# EAGLE design 555_556_Tester 2 (EAGLE 8.1.0)
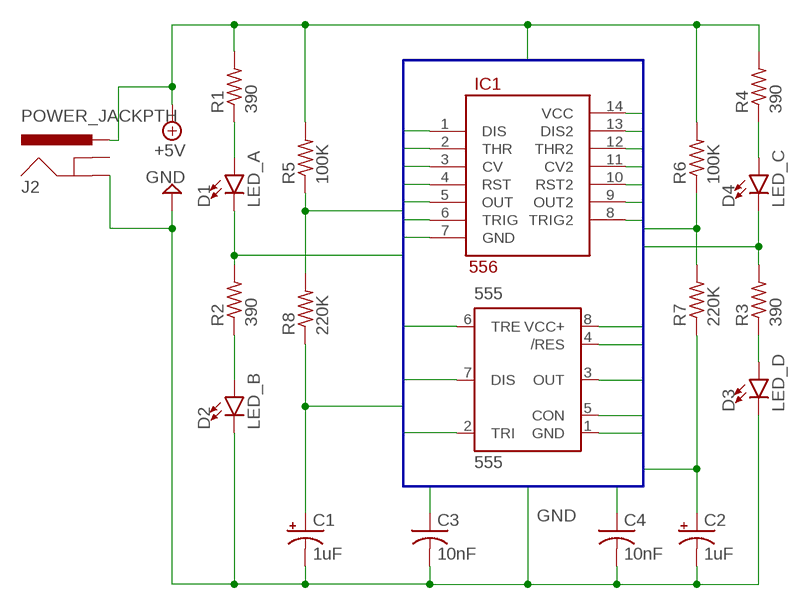
[diagram p0: schematic, sheet 1]

## Parts
555  555  NE555KIT  [DIP08-KIT]
C1  1uF  CPOL-USE2-4  [E2-4]
C2  1uF  CPOL-USE2-4  [E2-4]
C3  10nF  C-US025-025X050  [C025-025X050]
C4  10nF  C-US025-025X050  [C025-025X050]
D1  LED_A  LED3MM  [LED_3MM]
D2  LED_B  LED3MM  [LED_3MM]
D3  LED_D  LED3MM  [LED_3MM]
D4  LED_C  LED3MM  [LED_3MM]
IC1  556  556KIT  [DIL14-KIT]
J2  POWER_JACKPTH  [POWER_JACK_PTH]
R1  390  R-US_0204/5  [0204/5]
R2  390  R-US_0204/5  [0204/5]
R3  390  R-US_0204/5  [0204/5]
R4  390  R-US_0204/5  [0204/5]
R5  100K  R-US_0204/5  [0204/5]
R6  100K  R-US_0204/5  [0204/5]
R7  220K  R-US_0204/5  [0204/5]
R8  220K  R-US_0204/5  [0204/5]

## Nets
+5V: 555.4(/RES) 555.8(VCC+) IC1.4(RST) IC1.10(RST2) IC1.14(VCC) J2.PWR R1.2 R4.2 R5.2 R6.2
CV: 555.5(CON) C3.1 IC1.3(CV)
CV2: C4.1 IC1.11(CV2)
DIS: 555.7(DIS) IC1.1(DIS) R5.1 R8.2
DIS2: IC1.13(DIS2) R6.1 R7.2
GND: 555.1(GND) C1.- C2.- C3.2 C4.2 D2.K(C) D3.K(C) IC1.7(GND) J2.GND
N$1: D1.A R1.1
N$2: D2.A R2.1
N$6: D3.A R3.1
N$8: D4.A R4.1
OUT: 555.3(OUT) D1.K(C) IC1.5(OUT) R2.2
OUT2: D4.K(C) IC1.9(OUT2) R3.2
THR2_TRIG2: C2.+ IC1.8(TRIG2) IC1.12(THR2) R7.1
THR_TRIG: 555.2(TRI) 555.6(TRE) C1.+ IC1.2(THR) IC1.6(TRIG) R8.1
Unconnected: J2.GNDBREAK

## Buses
GND,DIS,THR_TRIG,CV,RST,OUT,VCC,DIS2,CV2,RST2,OUT2,THR2_TRIG2,+5V

## Library data of the parts
555 = SparkFun-AnalogIC:NE555: General purpose bipolar Timer; PROD_ID: IC-11930
C1 C2 = adafruit:CPOL-US: POLARIZED CAPACITOR, American symbol
C3 C4 = adafruit:C-US: CAPACITOR, American symbol
D1-D4 = SparkFun-LED:LED: LED (Generic) Standard schematic elements and footprints for 5mm, 3mm, 1206, and 0603 sized LEDs. Generic LEDs with no color specified.; PROD_ID: DIO-08794
IC1 = SparkFun-AnalogIC:556: Dual timer circuit (2 555 timers in one package)
J2 = SparkFun-Connectors:POWER_JACK: Power Jack This is the standard 5.5mm barrel jack for power. The PTH is the most common, proven, reliable, footprint. The Slot footprint only works if the mill layer is transmitted to the PCB fab house so be warned. Mating wall wart : TOL-00298 (and others); PROD_ID: CONN-08197
R1-R8 = adafruit:R-US_: RESISTOR, American symbol

## Module YAR
Ports: 

### Library data of the parts

## Board
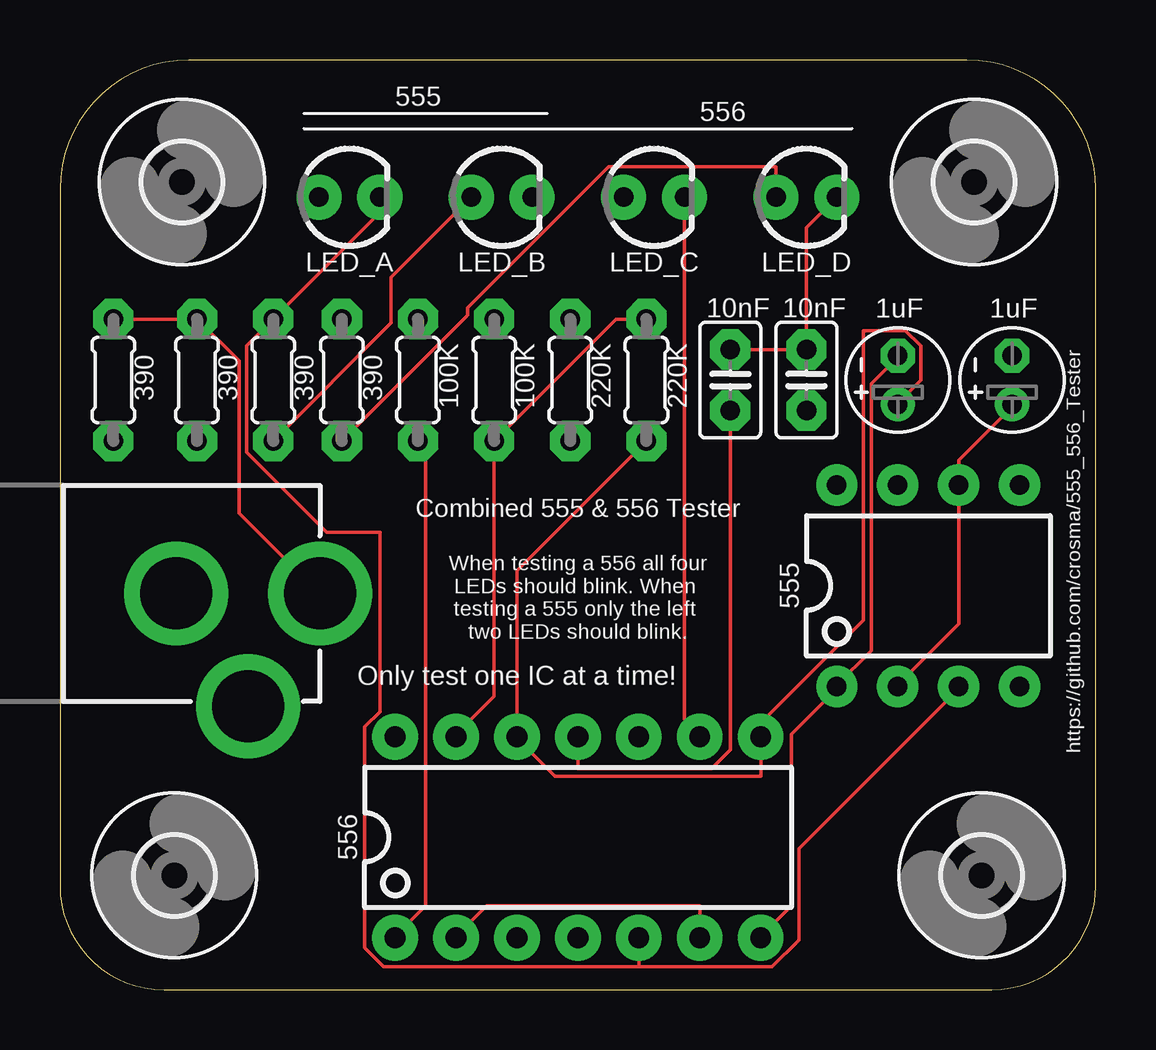
[diagram p1: board, top side]
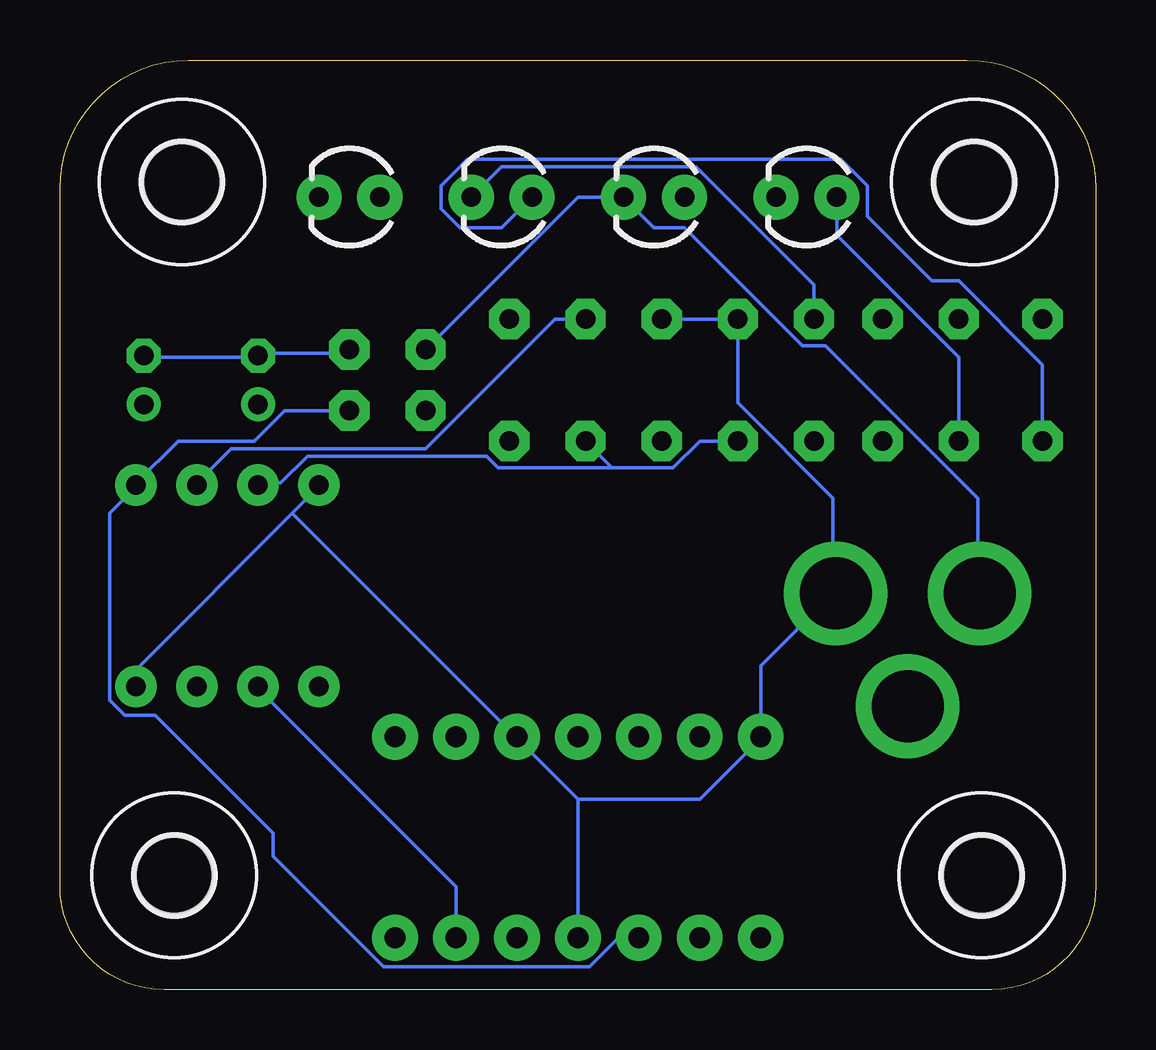
[diagram p2: board, bottom side, seen from below]

Size 43.18 x 38.73 mm. Coordinates in mm from the lower left corner, seen from the top.
Outline: 4.34,0 38.84,0 arc90 43.18,4.34 43.18,33.36 arc90 37.8,38.73 5.38,38.73 arc90 0,33.36 0,4.34 arc90 4.34,0
Copper layers (1*16): Top 0.0356mm / dielectric 1.5011mm / Bottom 0.0356mm
Design rules "oshpark-2layer": minimum track width 6mil, minimum drill 13mil, track to track 6mil, track to pad 6mil, pad to pad 6mil, via to via 6mil, smd to smd 6mil, copper to edge 15mil, drill to drill 6mil, minimum pad ring 7mil, minimum via ring 7mil, stop-mask expansion 2.5mil, vias tented up to drill 0mil, thermal gap 10mil

### Footprints (pad centres in the part's own frame; a part is rotated, then mirrored left to right if it is on the bottom)
DIP08-KIT = drill 0.813 pad 1.727: 1 -3.81,-4.191; 2 -1.27,-4.191; 3 1.27,-4.191; 4 3.81,-4.191; 5 3.81,4.191; 6 1.27,4.191; 7 -1.27,4.191; 8 -3.81,4.191
E2-4 = drill 0.813 pad 1.422: + -1.016,0 | drill 0.813 pad 1.422 octagon: - 1.016,0
C025-025X050 = drill 0.813 pad 1.676 octagon: 1 -1.27,0; 2 1.27,0
LED_3MM = drill 0.813 pad 1.88: A -1.27,0; K 1.27,0
DIL14-KIT = drill 0.864 pad 1.905: 1 -8.89,-4.191; 2 -6.35,-4.191; 3 -3.81,-4.191; 4 -1.27,-4.191; 5 1.27,-4.191; 6 3.81,-4.191; 7 6.35,-4.191; 8 6.35,4.191; 9 3.81,4.191; 10 1.27,4.191; 11 -1.27,4.191; 12 -3.81,4.191; 13 -6.35,4.191; 14 -8.89,4.191
POWER_JACK_PTH = drill 2.997 pad 4.318: GND 0,7.7; GNDBREAK 4.7,10.7; PWR 0,13.7
0204/5 = drill 0.813 pad 1.676 octagon: 1 -2.54,0; 2 2.54,0
3,2 = hole 3.2: 0,0

### Placement (x,y rotation side)
555  36.2,16.83 0 top
C1  39.69,25.4 90 top
C2  34.92,25.4 90 top
C3  31.11,25.4 90 top
C4  27.94,25.4 90 top
D1  12.06,33.02 0 top
D2  18.41,33.02 0 top
D3  31.11,33.02 0 top
D4  24.77,33.02 0 top
IC1  22.86,6.35 0 top
J2  -2.86,16.51 270 top
R1  5.71,25.4 90 top
R2  8.89,25.4 90 top
R3  11.75,25.4 90 top
R4  2.22,25.4 90 top
R5  14.92,25.4 90 top
R6  18.1,25.4 90 top
R7  24.45,25.4 90 top
R8  21.27,25.4 270 top
U$1  [3,2]  5.08,33.66 0 top
U$2  [3,2]  38.1,33.66 0 top
U$3  [3,2]  4.76,4.76 0 top
U$4  [3,2]  38.42,4.76 0 top

### Tracks (layer width: path | path; a pad name or v marks a point on that pad's centre or on a via)
+5V
  Top 0.152: R4.2 R1.2 7.46,26.19 7.46,19.84 10.79,16.51 J2.PWR
  Bottom 0.152: 555.4 40.01,13.34 33.5,19.84 | 33.5,19.84 32.38,20.95 555.8 | 21.59,7.94 IC1.4 | 24.13,10.48 21.59,7.94 | R6.2 R5.2 14.92,24.45 10.95,20.48 10.95,16.51 | 10.95,16.51 13.97,13.49 IC1.14 13.97,10.48 16.51,7.94 21.59,7.94 | 10.95,16.51 J2.PWR | 24.13,10.48 33.5,19.84 | 24.13,10.48 IC1.10
CV
  Bottom 0.152: C3.1 33.81,24.13 35.08,22.86 38.26,22.86 40.01,21.11 555.5 40.01,20.95 41.12,19.84 41.12,12.06 40.48,11.43 39.21,11.43 34.29,6.51 34.29,5.56 29.69,0.95 21.11,0.95 20,2.06 19.05,2.06 IC1.3
CV2
  Top 0.152: C4.1 27.94,10 27.15,9.21 21.59,9.21 IC1.11
DIS
  Top 0.152: R5.1 15.24,22.54 15.24,3.49 13.97,2.22 IC1.1
  Bottom 0.152: R5.1 16.51,22.86 17.62,21.75 20.16,21.75 | R8.2 20.16,21.75 | 20.16,21.75 24.92,21.75 25.4,22.23 32.86,22.23 33.97,21.11 34.92,21.11 555.7
DIS2
  Top 0.152: R7.2 23.18,27.94 R6.1 18.1,12.22 16.51,10.64 IC1.13
GND
  Top 0.152: IC1.7 29.21,2.22 30.48,3.49 30.48,10.64 32.38,12.54 555.1 32.38,12.7 33.81,14.13 33.81,25.24 34.92,26.35 C2.- | C4.2 C3.2 31.11,31.75 D3.K
  Bottom 0.152: C1.- 39.69,26.35 34.92,26.35 C2.- 34.92,26.51 31.27,26.51 C3.2 | C4.2 21.59,33.02 D2.K 18.41,31.75 17.14,31.75 12.22,26.83 11.27,26.83 4.92,20.48 4.92,16.51 J2.GND
N$1
  Bottom 0.152: R1.1 5.71,26.35 10.79,31.43 D1.A
N$2
  Top 0.152: R2.1 13.81,27.78 13.81,29.69 D2.A
N$6
  Top 0.152: R3.1 16.99,28.1 16.99,28.42 22.86,34.29 29.84,34.29 D3.A
N$8
  Bottom 0.152: R4.1 2.22,26.04 5.71,29.53 6.83,29.53 9.53,32.23 9.53,33.5 10.64,34.61 26.19,34.61 27.3,33.5 27.3,32.54 26.51,31.75 24.77,31.75 D4.A
OUT
  Top 0.152: D1.K 13.34,32.38 R2.2 7.78,26.83 7.78,22.38 11.11,19.05 13.34,19.05 13.34,11.59 12.7,10.95 12.7,1.75 13.49,0.95 24.13,0.95 | 24.13,0.95 29.69,0.95 30.8,2.06 30.8,5.87 37.47,12.54 555.3 | IC1.5 24.13,0.95
OUT2
  Top 0.152: D4.K 26.04,11.27 26.67,10.64 IC1.9
  Bottom 0.152: R3.2 11.75,29.37 16.67,34.29 24.77,34.29 D4.K
THR2_TRIG2
  Top 0.152: R7.1 19.05,17.46 IC1.12 19.05,10.48 20.64,8.89 29.21,8.89 IC1.8 29.21,11.11 33.5,15.4 33.5,27.46 35.24,27.46 35.88,26.83 35.88,25.4 34.92,24.45 C2.+
THR_TRIG
  Top 0.152: IC1.6 26.67,3.49 17.78,3.49 16.51,2.22 IC1.2 | C1.+ 39.69,24.29 37.47,22.07 555.6 37.47,15.24 34.92,12.7 555.2
  Bottom 0.152: R8.1 22.54,27.94 27.94,22.54 36.04,22.54 37.47,21.11 555.6 | IC1.6 26.67,4.29 34.92,12.54 555.2

### Text on the board
tPlace: 555 | 556 | Combined 555 & 556 Tester | When testing a 556 all four / LEDs should blink. When / testing a 555 only the left / two LEDs should blink. | Only test one IC at a time! | https://github.com/crosma/555_556_Tester